# Altium schematic sheet 15-FPGA-01b.SchDoc
size B; SheetNumber: 15; SheetTotal: 22
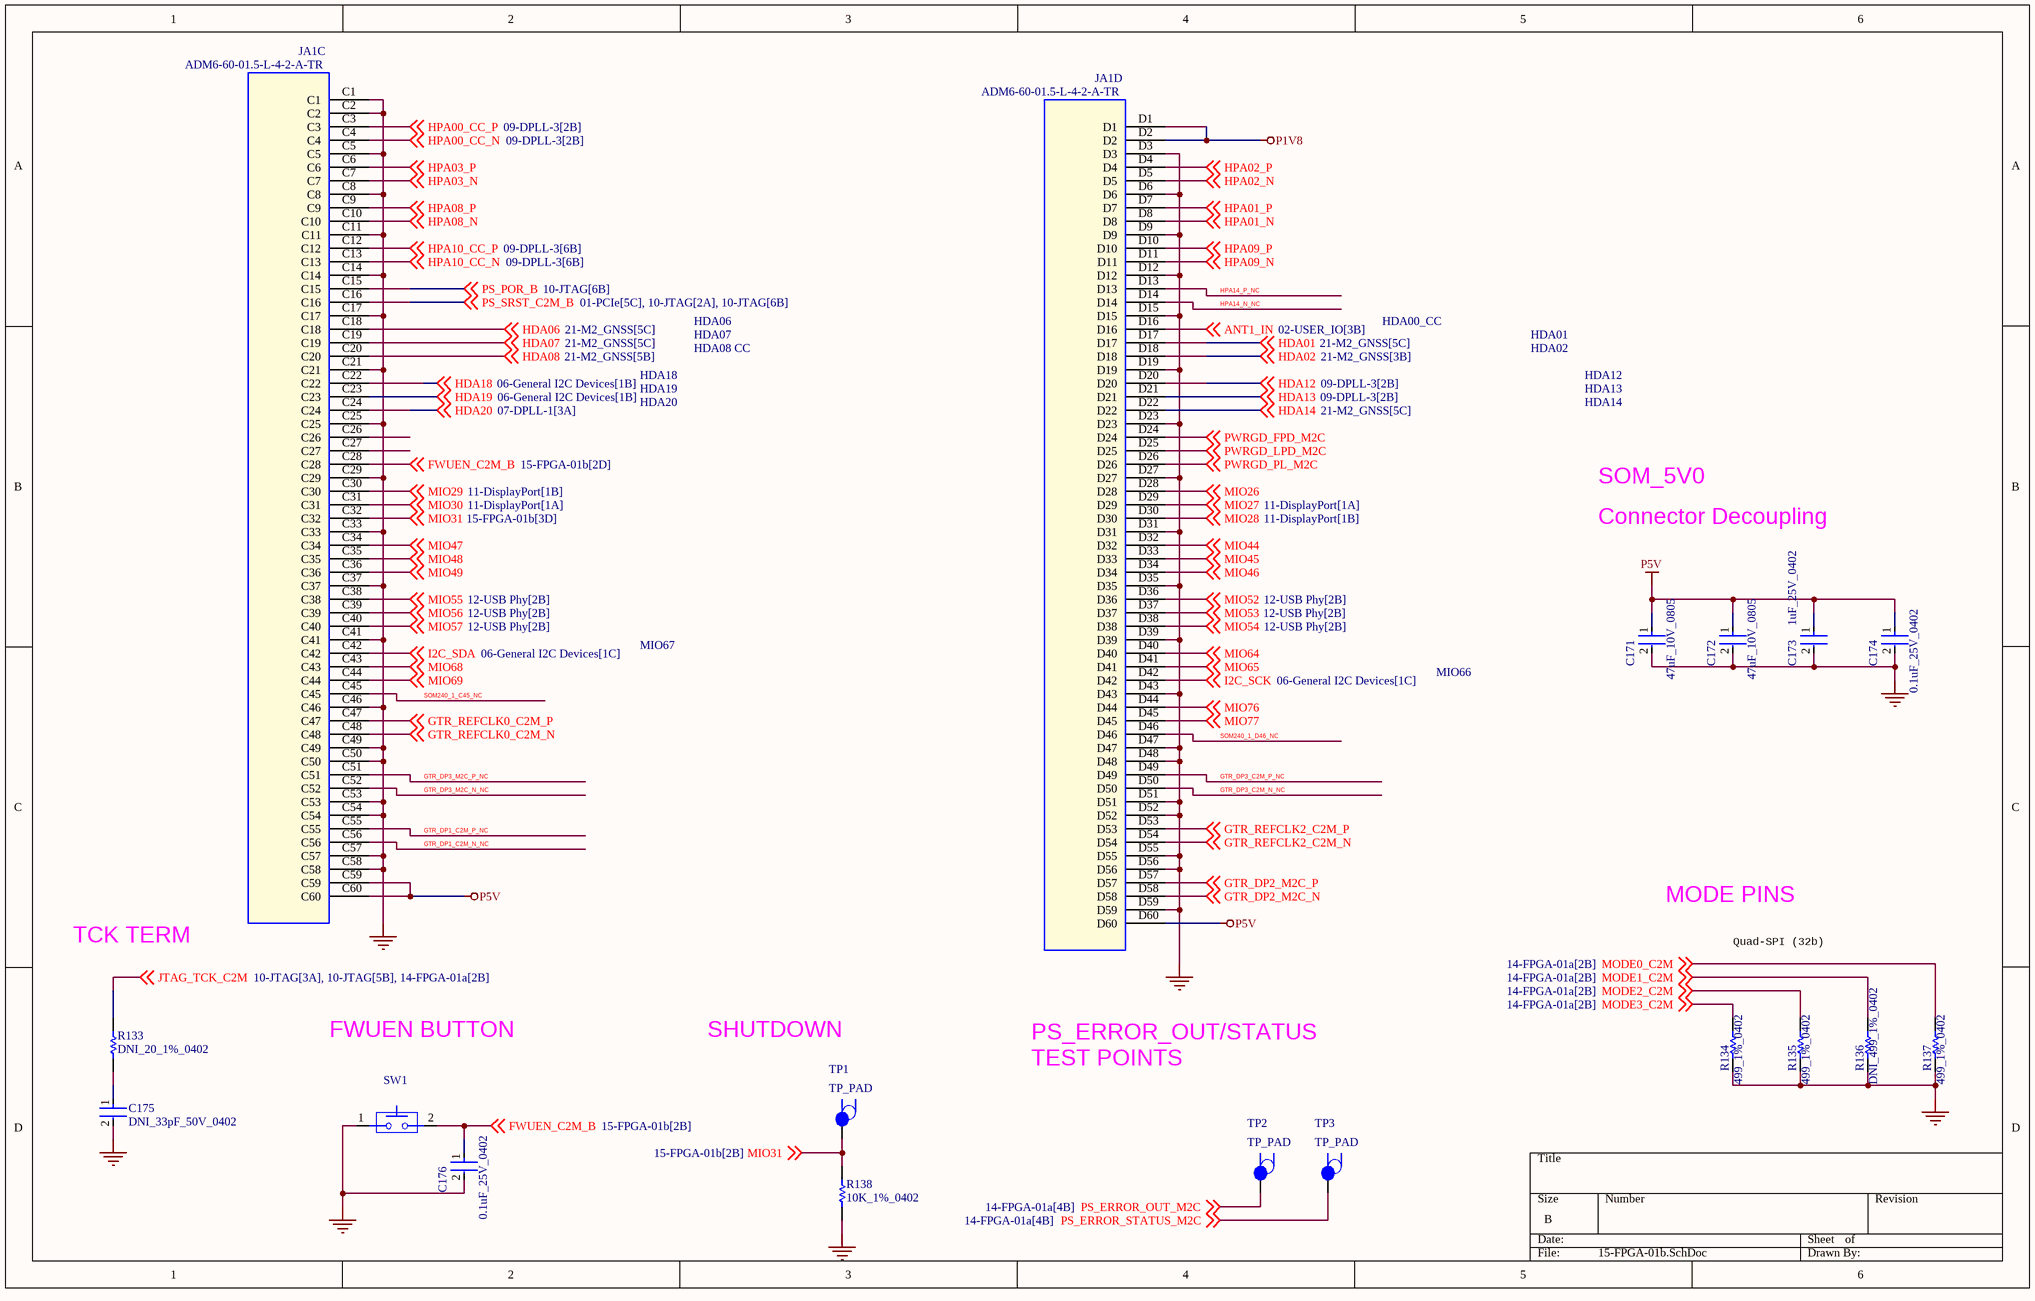
[diagram p0: 15-FPGA-01b.SchDoc]

## Parts
C171  47uF_10V_0805  [FP-GRM21B-0_2-e0_2_0_7-IPC_A]
C172  47uF_10V_0805  [FP-GRM21B-0_2-e0_2_0_7-IPC_A]
C173  1uF_25V_0402  [FP-CL542-IPC_C]
C174  0.1uF_25V_0402  [FP-0402-L_1_0_0_05-W_0_5-IPC_B]
C175  DNI_33pF_50V_0402  [FP-C1005-050-0_05-IPC_A]  (no BOM)
C176  0.1uF_25V_0402  [FP-0402-L_1_0_0_05-W_0_5-IPC_B]
JA1  ADM6-60-01.5-L-4-2-A-TR  [CON_SAMTEC_ADM6_60_4]  (parts C,D of 4)
R133  DNI_20_1%_0402  [RESC1005X40X25NL10T10]  (no BOM)
R134  499_1%_0402  [RESC1005X40X25LL05T05]
R135  499_1%_0402  [RESC1005X40X25LL05T05]
R136  DNI_499_1%_0402  [RESC1005X40X25LL05T05]  (no BOM)
R137  499_1%_0402  [RESC1005X40X25LL05T05]
R138  10K_1%_0402  [RESC1005X40X25ML05T05]
SW1  B3U-1000P  [SW_OMRON_2P]  (value not drawn)
TP1  TP_PAD  [TP_PAD]
TP2  TP_PAD  [TP_PAD]
TP3  TP_PAD  [TP_PAD]

## Nets
GND: C171.2 C172.2 C173.2 C174.2 C175.2 C176.2 JA1.C1 JA1.C2 JA1.C5 JA1.C8 JA1.C11 JA1.C14 JA1.C17 JA1.C21 JA1.C25 JA1.C29 JA1.C33 JA1.C37 JA1.C41 JA1.C46 JA1.C49 JA1.C50 JA1.C53 JA1.C54 JA1.C57 JA1.C58 JA1.D3 JA1.D6 JA1.D9 JA1.D12 JA1.D15 JA1.D19 JA1.D23 JA1.D27 JA1.D31 JA1.D35 JA1.D39 JA1.D43 JA1.D47 JA1.D48 JA1.D51 JA1.D52 JA1.D55 JA1.D56 JA1.D59 R134.1 R135.1 R136.1 R137.1 R138.1 SW1.1(SW1)
P1V8: JA1.D1 JA1.D2
P5V: C171.1 C172.1 C173.1 C174.1 JA1.C59 JA1.C60 JA1.D60
ANT1_IN: JA1.D16 ; off-sheet ANT1_IN
FWUEN_C2M_B: C176.1 JA1.C28 SW1.2(SW2) ; off-sheet FWUEN_C2M_B
GTR_DP1_C2M_N_NC: JA1.C56
GTR_DP1_C2M_P_NC: JA1.C55
GTR_DP2_M2C_N: JA1.D58 ; off-sheet GTR_DP2_M2C_N
GTR_DP2_M2C_P: JA1.D57 ; off-sheet GTR_DP2_M2C_P
GTR_DP3_C2M_N_NC: JA1.D50
GTR_DP3_C2M_P_NC: JA1.D49
GTR_DP3_M2C_N_NC: JA1.C52
GTR_DP3_M2C_P_NC: JA1.C51
GTR_REFCLK0_C2M_N: JA1.C48 ; off-sheet GTR_REFCLK0_C2M_N
GTR_REFCLK0_C2M_P: JA1.C47 ; off-sheet GTR_REFCLK0_C2M_P
GTR_REFCLK2_C2M_N: JA1.D54 ; off-sheet GTR_REFCLK2_C2M_N
GTR_REFCLK2_C2M_P: JA1.D53 ; off-sheet GTR_REFCLK2_C2M_P
HDA01: JA1.D17 ; off-sheet HDA01
HDA02: JA1.D18 ; off-sheet HDA02
HDA06: JA1.C18 ; off-sheet HDA06
HDA07: JA1.C19 ; off-sheet HDA07
HDA08: JA1.C20 ; off-sheet HDA08
HDA12: JA1.D20 ; off-sheet HDA12
HDA13: JA1.D21 ; off-sheet HDA13
HDA14: JA1.D22 ; off-sheet HDA14
HDA18: JA1.C22 ; off-sheet HDA18
HDA19: JA1.C23 ; off-sheet HDA19
HDA20: JA1.C24 ; off-sheet HDA20
HPA00_CC_N: JA1.C4 ; off-sheet HPA00_CC_N
HPA00_CC_P: JA1.C3 ; off-sheet HPA00_CC_P
HPA01_N: JA1.D8 ; off-sheet HPA01_N
HPA01_P: JA1.D7 ; off-sheet HPA01_P
HPA02_N: JA1.D5 ; off-sheet HPA02_N
HPA02_P: JA1.D4 ; off-sheet HPA02_P
HPA03_N: JA1.C7 ; off-sheet HPA03_N
HPA03_P: JA1.C6 ; off-sheet HPA03_P
HPA08_N: JA1.C10 ; off-sheet HPA08_N
HPA08_P: JA1.C9 ; off-sheet HPA08_P
HPA09_N: JA1.D11 ; off-sheet HPA09_N
HPA09_P: JA1.D10 ; off-sheet HPA09_P
HPA10_CC_N: JA1.C13 ; off-sheet HPA10_CC_N
HPA10_CC_P: JA1.C12 ; off-sheet HPA10_CC_P
HPA14_N_NC: JA1.D14
HPA14_P_NC: JA1.D13
I2C_SCK: JA1.D42 ; off-sheet I2C_SCK
I2C_SDA: JA1.C42 ; off-sheet I2C_SDA
JTAG_TCK_C2M: R133.2 ; off-sheet JTAG_TCK_C2M
MIO26: JA1.D28 ; off-sheet MIO26
MIO27: JA1.D29 ; off-sheet MIO27
MIO28: JA1.D30 ; off-sheet MIO28
MIO29: JA1.C30 ; off-sheet MIO29
MIO30: JA1.C31 ; off-sheet MIO30
MIO31: JA1.C32 R138.2 TP1.1(TP) ; off-sheet MIO31
MIO44: JA1.D32 ; off-sheet MIO44
MIO45: JA1.D33 ; off-sheet MIO45
MIO46: JA1.D34 ; off-sheet MIO46
MIO47: JA1.C34 ; off-sheet MIO47
MIO48: JA1.C35 ; off-sheet MIO48
MIO49: JA1.C36 ; off-sheet MIO49
MIO52: JA1.D36 ; off-sheet MIO52
MIO53: JA1.D37 ; off-sheet MIO53
MIO54: JA1.D38 ; off-sheet MIO54
MIO55: JA1.C38 ; off-sheet MIO55
MIO56: JA1.C39 ; off-sheet MIO56
MIO57: JA1.C40 ; off-sheet MIO57
MIO64: JA1.D40 ; off-sheet MIO64
MIO65: JA1.D41 ; off-sheet MIO65
MIO68: JA1.C43 ; off-sheet MIO68
MIO69: JA1.C44 ; off-sheet MIO69
MIO76: JA1.D44 ; off-sheet MIO76
MIO77: JA1.D45 ; off-sheet MIO77
MODE0_C2M: R137.2 ; off-sheet MODE0_C2M
MODE1_C2M: R136.2 ; off-sheet MODE1_C2M
MODE2_C2M: R135.2 ; off-sheet MODE2_C2M
MODE3_C2M: R134.2 ; off-sheet MODE3_C2M
PS_ERROR_OUT_M2C: TP2.1(TP) ; off-sheet PS_ERROR_OUT_M2C
PS_ERROR_STATUS_M2C: TP3.1(TP) ; off-sheet PS_ERROR_STATUS_M2C
PS_POR_B: JA1.C15 ; off-sheet PS_POR_B
PS_SRST_C2M_B: JA1.C16 ; off-sheet PS_SRST_C2M_B
PWRGD_FPD_M2C: JA1.D24 ; off-sheet PWRGD_FPD_M2C
PWRGD_LPD_M2C: JA1.D25 ; off-sheet PWRGD_LPD_M2C
PWRGD_PL_M2C: JA1.D26 ; off-sheet PWRGD_PL_M2C
SOM240_1_C45_NC: JA1.C45
SOM240_1_D46_NC: JA1.D46
NetC175_1: C175.1 R133.1

Not connected (* = marked no-connect by the designer): JA1 C26 C27

## Notes on the sheet
- HDA06
- HDA07
- HDA08 CC
- HDA00_CC
- HDA01
- HDA02
- HDA18
- HDA19
- HDA20
- HDA12
- HDA13
- HDA14
- SOM_5V0
- Connector Decoupling
- MIO67
- MIO66
- MODE PINS
- TCK TERM
- Quad-SPI (32b)
- FWUEN BUTTON
- SHUTDOWN
- PS_ERROR_OUT/STATUS
  TEST POINTS

## Library data of the parts
C171 C172 = CMP-2000-06341-2: Chip Multilayer Ceramic Capacitors for General Purpose, 0805, 47uF, X5R, 15%, 20%, 10V; Dissipation Factor: 0.035%; Length: 2mm; Voltage Rating: 10V; Mount: Surface Mount; Width: 0.049inch; Voltage Rating (DC): 10V; Lead Free: Lead Free; REACH SVHC: No SVHC; Termination: SMD/SMT; Case/Package: 0805; Dielectric: X5R; Capacitance: 47uF; Packaging: Tape and Reel; Max Operating Temperature: 85°C; Tolerance: 20%; Thickness: 0.057inch; Dielectric Material: Ceramic; Min Operating Temperature: -55°C; Height: 1.25mm; Case Code (Imperial): 0805; Case Code (Metric): 2012; Depth: 1.25mm; Voltage: 10V
C173 = CMP-13271-001051-1: Cap Ceramic 1uF 25V X5R ±10% SMD 0402 +85°C Paper T/R; Radiation Hardening: No; Lead Free: Lead Free; Capacitance: 1uF; Package Quantity: 10000; Max Operating Temperature: 85°C; Voltage Rating: 25V; Case/Package: 0402; Min Operating Temperature: -55°C; Packaging: Tape and Reel; Tolerance: 10%; Height: 0.5mm; Thickness: 0.022inch; Case Code (Metric): 1005; Width: 0.02inch; Case Code (Imperial): 0402; Dielectric: X5R; Length: 1mm; Mount: Surface Mount; Material: Ceramic; Depth: 0.5mm
C174 C176 = CMP-14477-000014-3: None; Voltage Rating (DC): 25V; Tolerance: 10%; Capacitance: 100nF; Dielectric: X5R; Max Operating Temperature: 85°C; Resistor Type: Ceramic; Packaging: Tape and Reel; Lead Free: Lead Free; Case Code (Imperial): 0402; Thickness: 0.022inch; Series: M; Construction: Flat; Number of Pins: 2; Width: 0.5mm; Halogen Free: Halogen Free; Case/Package: 0402; Voltage: 25V; Height: 0.5mm; Mount: Surface Mount; Min Operating Temperature: -55°C; Case Code (Metric): 1005; Length: 1mm; Depth: 0.5mm; Voltage Rating: 25V; Package Quantity: 1; Weight: 2.3E-05oz; RoHS Compliant: Yes; Termination: SMD/SMT; REACH SVHC: No SVHC
C175 = CMP-08246-002761-1: Multilayer Ceramic Capacitors 33pF ±1% 50V C0G SMD 0402; Weight: 2.3E-05oz; Case/Package: 0402; Mount: Surface Mount; REACH SVHC: No SVHC; Voltage Rating (DC): 50V; Voltage Rating: 50V; Max Operating Temperature: 125°C; Packaging: Tape and Reel; Length: 0.039inch; Dielectric: C0G; Case Code (Imperial): 0402; Height: 0.5mm; Termination: SMD/SMT; Min Operating Temperature: -55°C; Thickness: 0.022inch; Lead Free: Lead Free; Depth: 0.5mm; Dielectric Material: Ceramic; Package Quantity: 1; Case Code (Metric): 1005; Capacitance: 33pF; RoHS Compliant: Yes; Series: C; Width: 0.02inch; Tolerance: 1%
JA1 = SAMTEC-ADx6-60X4: Conn Rcpt Male Vert 240 Pos 4x60 0.635mm P Black SMT; Manufacturer: Samtec Inc.; Agile Part Number: CON-00383-01; SPLIT_INST: TRUE; SWAP_INFO: (S1+S2+S3+S4); Pitch: 0.025" (0.64mm); Barcode: 40000092; Datasheet: http://suddendocs.samtec.com/catalog_english/adf6.pdf; Manufacturer PN: ADM6-60-01.5-L-4-2-A-TR; PCB Footprint: CON_SAMTEC_ADM6_60_4; CIP Link: http://xsjbrdwin1/CIP-E/Component/Index/All?pn=40000092; Number of Pins: 240; Part Type: CONNECTOR
R133 = CMP-2002-05710-1: Manufacturer: TE Connectivity / AMP; Part Number: CRG0402F20R
R134-R137 = CMP-2002-00038-1: Manufacturer: Vishay Dale; Part Number: CRCW0402499RFKTD
R138 = CMP-2002-00433-1: Part Number: ERJ-2GEJ103X; Manufacturer: Panasonic
SW1 = BTN_MOMENT: Switch SPST-NO Mom 50mA 12V 1.6mm H 1.5Nw SMT IP40; Manufacturer: OMRON; Agile Part Number: SWH-00003-01; EDMVersionID: 489329634; Barcode: 440024; Manufacturer PN: B3U-1000P; PCB Footprint: SW_OMRON_2P; CIP Link: http://xsjbrdwin1/CIP-E/Component/Index/All?pn=440024; Part Type: MOMENT
TP1-TP3 = TP: TEST POINT 24mil SM pad; EDMVersionID: 493452275; ASSEMBLY_OPTIONS: DNP; Barcode: 96000010; MANF_P/N: DNP; OWNER: 3709; PCB Footprint: TP_PAD; PartType: TEST POINT; Pins: 1PIN; ROHS: Yes; Datasheet: NA; MANF: DNP; DEVICE: TP_PAD; Part Type: Unassigned Part Type; CIP Link: http://xsjbrdwin1/CIP-E/Component/Index/All?pn=96000010